# Altium schematic sheet [02] Block Diagram.SchDoc: Block Diagram
size A4; Organization: Blinkinlabs, LLC; DocumentNumber: 2; SheetNumber: 2; SheetTotal: 7
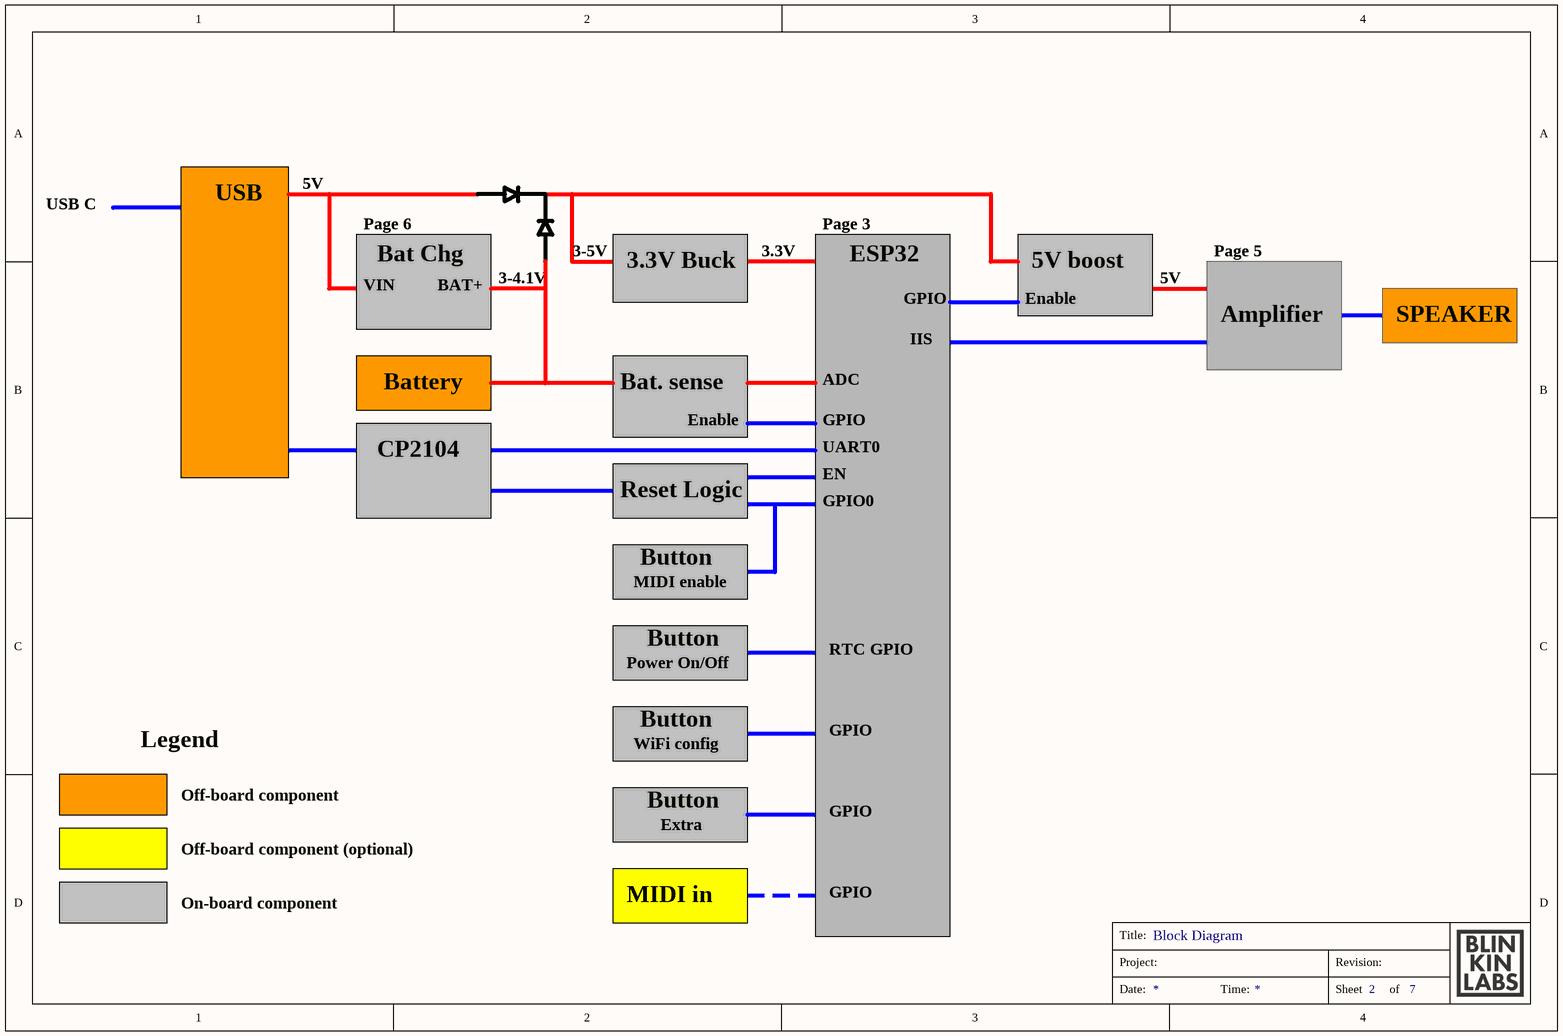
[diagram p0: [02] Block Diagram.SchDoc]

## Notes on the sheet
- USB C
- USB
- 5V
- Page 6
- Page 3
- VIN
- Bat Chg
- BAT+
- 3-4.1V
- 3-5V
- 3.3V Buck
- 3.3V
- ESP32
- GPIO
- Enable
- 5V boost
- Page 5
- ADC
- IIS
- Amplifier
- SPEAKER
- Battery
- Bat. sense
- CP2104
- Reset Logic
- UART0
- EN
- GPIO0
- Button
- MIDI enable
- RTC GPIO
- Power On/Off
- Legend
- Off-board component
- WiFi config
- Off-board component (optional)
- Extra
- On-board component
- MIDI in
- Title:
- Project:
- Revision:
- Date:
- Time:
- Sheet
- of